# EAGLE design main (EAGLE 9.5.2)
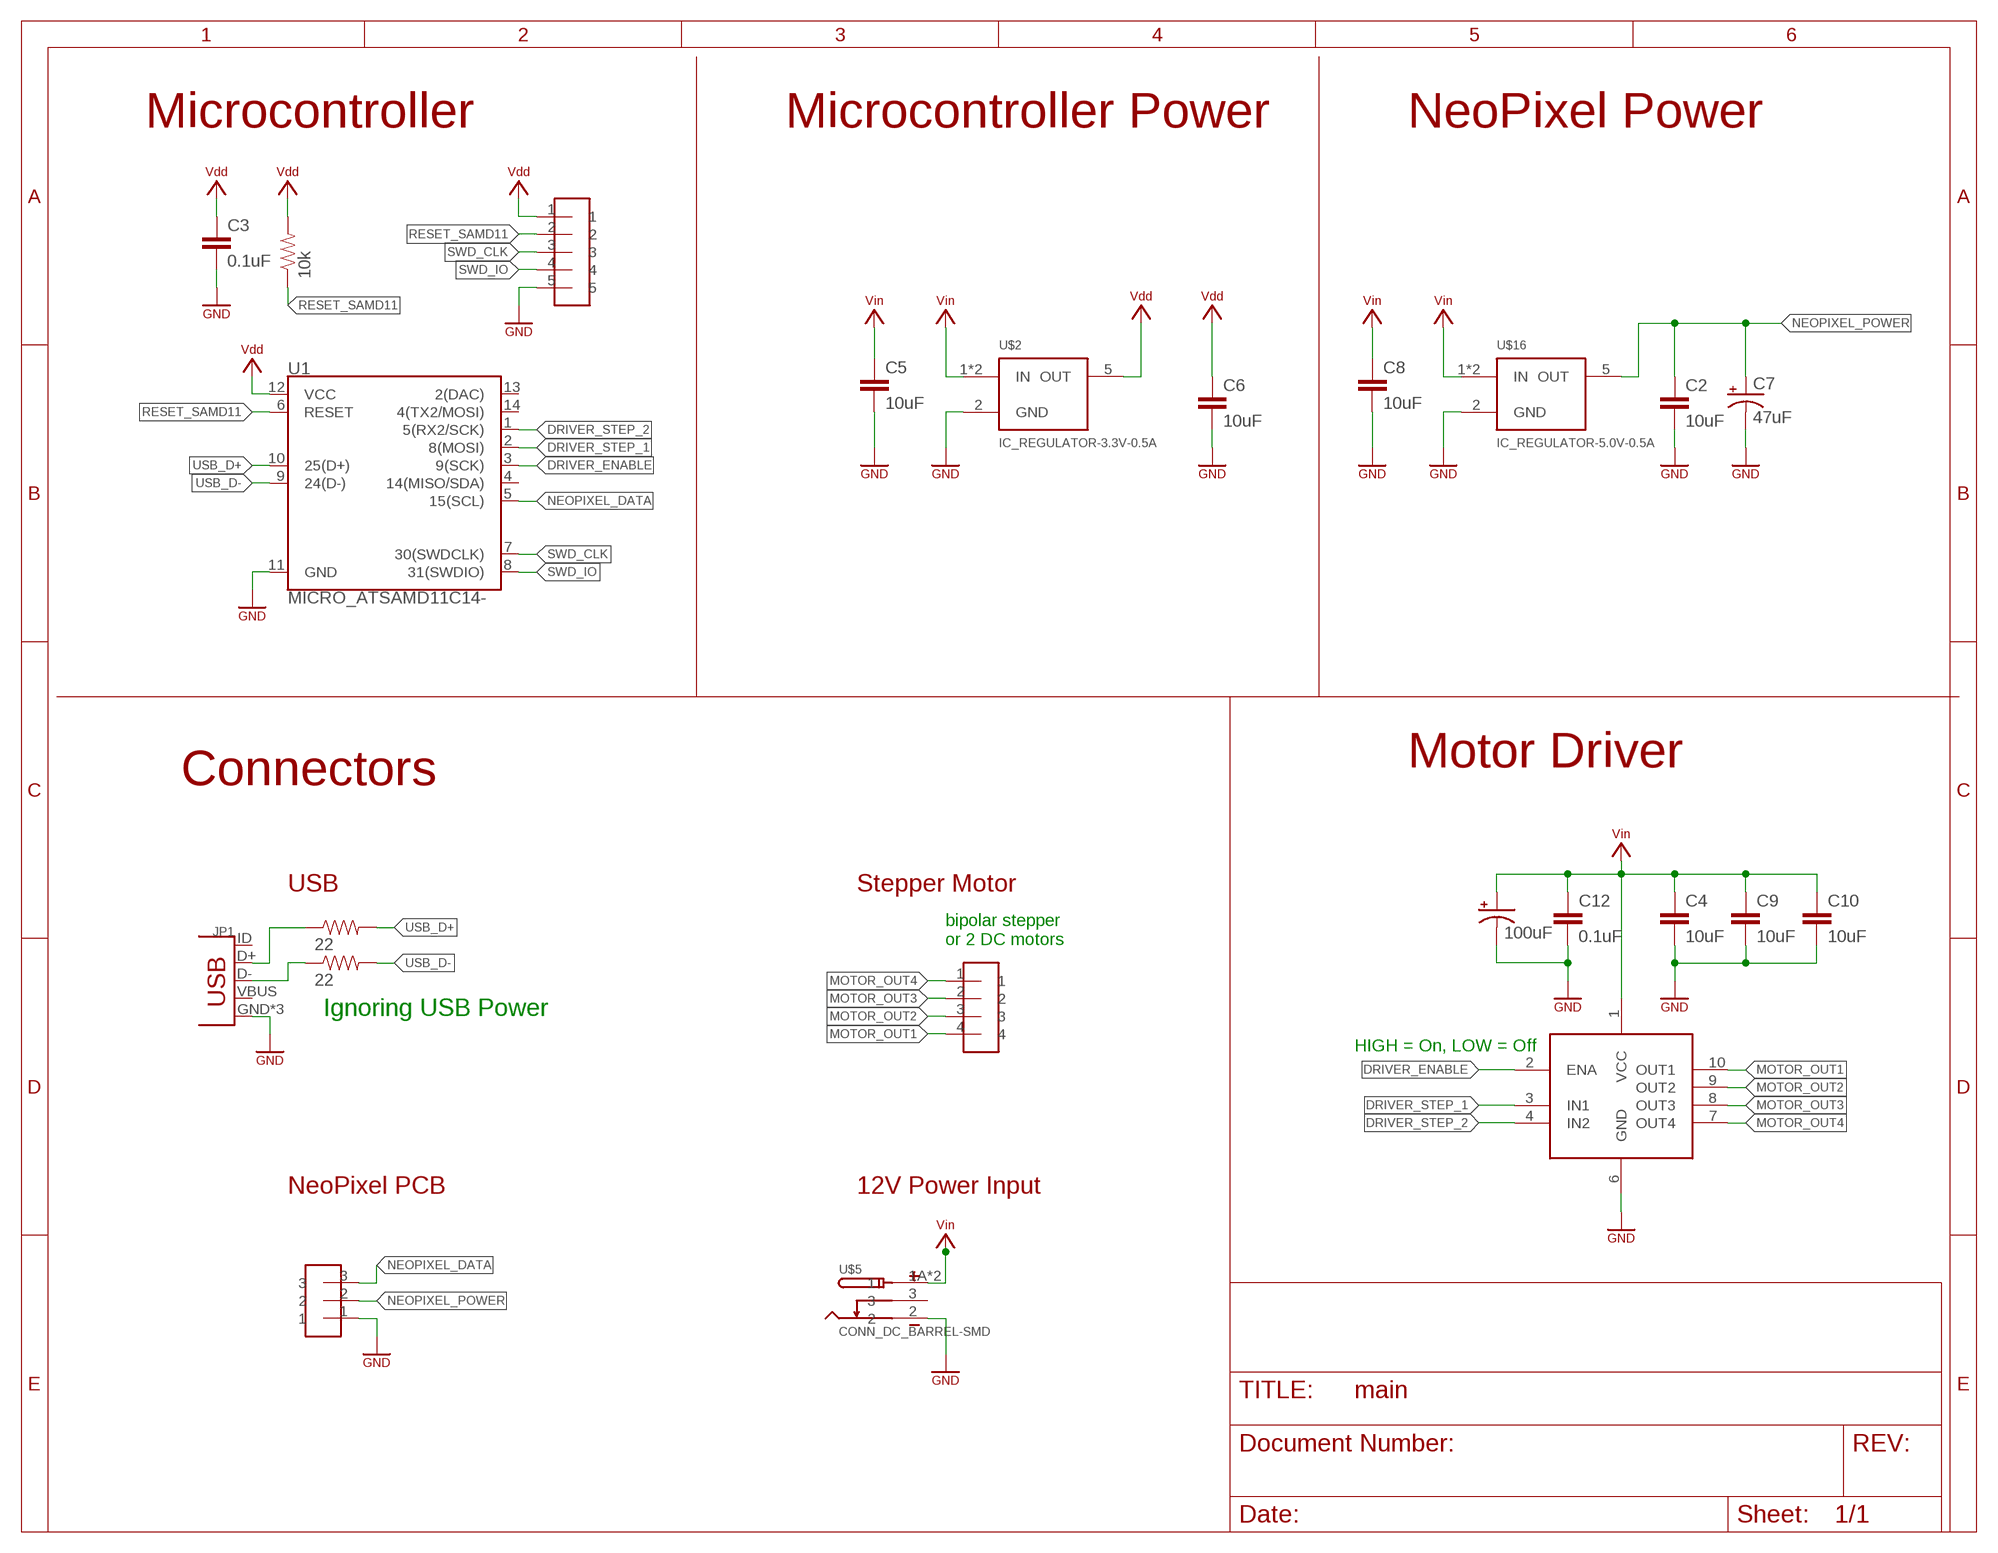
[diagram p0: schematic, sheet 1]

## Parts
C1  100uF  COMPONENT_CAP_POL-8MM  [CAP_RADIAL_CAN_8MM]
C2  10uF  COMPONENT_CAP-0805  [0805]
C3  0.1uF  COMPONENT_CAP-0805  [0805]
C4  10uF  COMPONENT_CAP-0805  [0805]
C5  10uF  COMPONENT_CAP-0805  [0805]
C6  10uF  COMPONENT_CAP-0805  [0805]
C7  47uF  COMPONENT_CAP_POL-6.3MM  [CAP_RADIAL_CAN_6.3MM]
C8  10uF  COMPONENT_CAP-0805  [0805]
C9  10uF  COMPONENT_CAP-0805  [0805]
C10  10uF  COMPONENT_CAP-0805  [0805]
C12  0.1uF  COMPONENT_CAP-0805  [0805]
JP1  CONN_USB-10118192-0001LF  [USB-MICRO-FEMALE]
R1  10k  COMPONENT_RESISTOR-0805  [0805]
R2  22  COMPONENT_RESISTOR-0805  [0805]
R3  22  COMPONENT_RESISTOR-0805  [0805]
U1  MICRO_ATSAMD11C14-  [SOIC14]
U$1  HEADER-4-HORIZONTAL  [HEADER-4-HORIZONTAL]
U$2  IC_REGULATOR-3.3V-0.5A  [SOT23-5]
U$3  IC_H_BRIDGE_LV8549MC  [SOIC10]
U$5  CONN_DC_BARREL-SMD  [694106106102]
U$10  HEADER-5-TESTPOINT  [TESTPOINT-5]
U$16  IC_REGULATOR-5.0V-0.5A  [SOT23-5]
U$17  HEADER-3-HORIZONTAL  [HEADER-3-HORIZONTAL]

## Nets
DRIVER_ENABLE: U1.3(9(SCK)) U$3.2(ENA)
DRIVER_STEP_1: U1.2(8(MOSI)) U$3.3(IN1)
DRIVER_STEP_2: U1.1(5(RX2/SCK)) U$3.4(IN2)
GND: C1.- C2.2 C3.2 C4.2 C5.2 C6.2 C7.- C8.2 C9.2 C10.2 C12.2 JP1.GND JP1.MT1(GND) JP1.MT2(GND) U1.11(GND) U$2.2(GND) U$3.6(GND) U$5.2 U$10.5 U$16.2(GND) U$17.1 ; supply symbol labelled SYMBOL_GND
MOTOR_OUT1: U$1.4 U$3.10(OUT1)
MOTOR_OUT2: U$1.3 U$3.9(OUT2)
MOTOR_OUT3: U$1.2 U$3.8(OUT3)
MOTOR_OUT4: U$1.1 U$3.7(OUT4)
N$1: JP1.D+ R2.1
N$2: JP1.D- R3.1
NEOPIXEL_DATA: U1.5(15(SCL)) U$17.3
NEOPIXEL_POWER: C2.1 C7.+ U$16.5(OUT) U$17.2
RESET_SAMD11: R1.1 U1.6(RESET) U$10.2
SWD_CLK: U1.7(30(SWDCLK)) U$10.3
SWD_IO: U1.8(31(SWDIO)) U$10.4
USB_D+: R2.2 U1.10(25(D+))
USB_D-: R3.2 U1.9(24(D-))
VDD: C3.1 C6.1 R1.2 U1.12(VCC) U$2.5(OUT) U$10.1 ; supply symbol labelled SYMBOL_VDD
VIN: C1.+ C4.1 C5.1 C8.1 C9.1 C10.1 C12.1 U$2.1(IN) U$2.3(IN) U$3.1(VCC) U$5.1A U$5.1B U$16.1(IN) U$16.3(IN) ; supply symbol labelled SYMBOL_VIN
Unconnected: JP1.ID(SHIELD) JP1.VBUS U1.4(14(MISO/SDA)) U1.13(2(DAC)) U1.14(4(TX2/MOSI)) U$5.3

## Notes on the sheet
- Microcontroller | Microcontroller Power | NeoPixel Power
- Motor Driver
- Connectors
- USB | Stepper Motor
- bipolar stepper
  or 2 DC motors
- Ignoring USB Power
- HIGH = On, LOW = Off
- NeoPixel PCB | 12V Power Input

## Library data of the parts
C1 C7 = homemade-hardware:COMPONENT_CAP_POL: Capacitor Polarized These are standard SMD and PTH capacitors. Normally 47uF, 100uF, and 470uF in electrolytic and tantalum varieties. Always verify the external diameter of the through hole cap, it varies with capacity, voltage, and manufacturer. The EIA devices should be standard.
C2-C6 C8-C10 C12 = homemade-hardware:COMPONENT_CAP: Capacitor Standard 0603 ceramic capacitor, and 0.1" leaded capacitor.
JP1 = homemade-hardware:CONN_USB: 1-1734346-1 <https://www.digikey.com/product-detail/en/te-connectivity-amp-connectors/1-1734346-1/A110862CT-ND/4142246>: USB-B Female Receptacle 10118192-0001LF <https://www.digikey.com/products/en/connectors-interconnects/usb-dvi-hdmi-connectors/312?k=10118192-0001lf&k=&pkeyword=10118192-0001lf&sv=0&pv7=2&sf=0&quantity=&ColumnSort=0&page=1&pageSize=25>: USB-Micro Receptacle 87583-3010RPALF <https://www.digikey.com/product-detail/en/amphenol-icc-fci/87583-3010RPALF/609-4946-6-ND/5355479>: USB-A Female Receptacle 0480372100 <https://www.digikey.com/product-detail/en/molex/0480372100/WM13995DKR-ND/6204368>: USB-A Male Connector; PROD_ID: CONN-09505
R1-R3 = homemade-hardware:COMPONENT_RESISTOR
U1 = homemade-hardware:MICRO_ATSAMD11C14: ATSAMD11C14A <https://www.digikey.com/product-detail/en/microchip-technology/ATSAMD11C14A-SSNT/ATSAMD11C14A-SSNTCT-ND/5956608>: Native USB M0 (arduino core <https://github.com/mattairtech/ArduinoCore-samd>)
U$1 = homemade-hardware:HEADER-4: NPTC081KFXC-RC <https://www.digikey.com/product-detail/en/sullins-connector-solutions/NPTC081KFXC-RC/S5600-ND/776058>: Vertical Female SMD Headers TSM-110-01-T-SV <https://www.digikey.com/product-detail/en/samtec-inc/TSM-110-01-T-SV/SAM12267-ND/6691889>: Vertical Male SMD Headers M20-8890845 <https://www.digikey.com/products/en?keywords=952-3236-ND>: Horizontal Male SMD Headers M20-7910842R <https://www.digikey.com/product-detail/en/harwin-inc/M20-7910842R/952-3200-6-ND/6559341>: Horizontal Female SMD Headers
U$2 = homemade-hardware:IC_REGULATOR: SPX3819M5-L-5-0/TR <https://www.digikey.com/product-detail/en/maxlinear-inc/SPX3819M5-L-5-0-TR/1016-1874-6-ND/3586704>: 5.0V/0.5A SMD Linear Regulator SPX3819M5-L-3-3/TR <https://www.digikey.com/product-detail/en/maxlinear-inc/SPX3819M5-L-3-3-TR/1016-1873-6-ND/3586703>: 3.3V/0.5A SMD Linear Regulator; PN: SPX3819M5-L-3-3/TR
U$3 = homemade-hardware:IC_H_BRIDGE_LV8549MC
U$5 = homemade-hardware:CONN_DC_BARREL: 694106106102 <https://www.digikey.com/products/en/connectors-interconnects/barrel-power-connectors/435?k=694106106102&k=&pkeyword=694106106102&sv=0&pv7=2&sf=0&quantity=&ColumnSort=0&page=1&pageSize=25>: SMD DC Barrel (OD=5.5mm, ID=2mm)
U$10 = homemade-hardware:HEADER-5: NPTC081KFXC-RC <https://www.digikey.com/product-detail/en/sullins-connector-solutions/NPTC081KFXC-RC/S5600-ND/776058>: Vertical Female SMD Headers TSM-110-01-T-SV <https://www.digikey.com/product-detail/en/samtec-inc/TSM-110-01-T-SV/SAM12267-ND/6691889>: Vertical Male SMD Headers M20-8890845 <https://www.digikey.com/products/en?keywords=952-3236-ND>: Horizontal Male SMD Headers M20-7910842R <https://www.digikey.com/product-detail/en/harwin-inc/M20-7910842R/952-3200-6-ND/6559341>: Horizontal Female SMD Headers
U$16 = homemade-hardware:IC_REGULATOR: SPX3819M5-L-5-0/TR <https://www.digikey.com/product-detail/en/maxlinear-inc/SPX3819M5-L-5-0-TR/1016-1874-6-ND/3586704>: 5.0V/0.5A SMD Linear Regulator SPX3819M5-L-3-3/TR <https://www.digikey.com/product-detail/en/maxlinear-inc/SPX3819M5-L-3-3-TR/1016-1873-6-ND/3586703>: 3.3V/0.5A SMD Linear Regulator; PN: SPX3819M5-L-5-0/TR
U$17 = homemade-hardware:HEADER-3: NPTC081KFXC-RC <https://www.digikey.com/product-detail/en/sullins-connector-solutions/NPTC081KFXC-RC/S5600-ND/776058>: Vertical Female SMD Headers TSM-110-01-T-SV <https://www.digikey.com/product-detail/en/samtec-inc/TSM-110-01-T-SV/SAM12267-ND/6691889>: Vertical Male SMD Headers M20-8890845 <https://www.digikey.com/products/en?keywords=952-3236-ND>: Horizontal Male SMD Headers M20-7910842R <https://www.digikey.com/product-detail/en/harwin-inc/M20-7910842R/952-3200-6-ND/6559341>: Horizontal Female SMD Headers

## Board
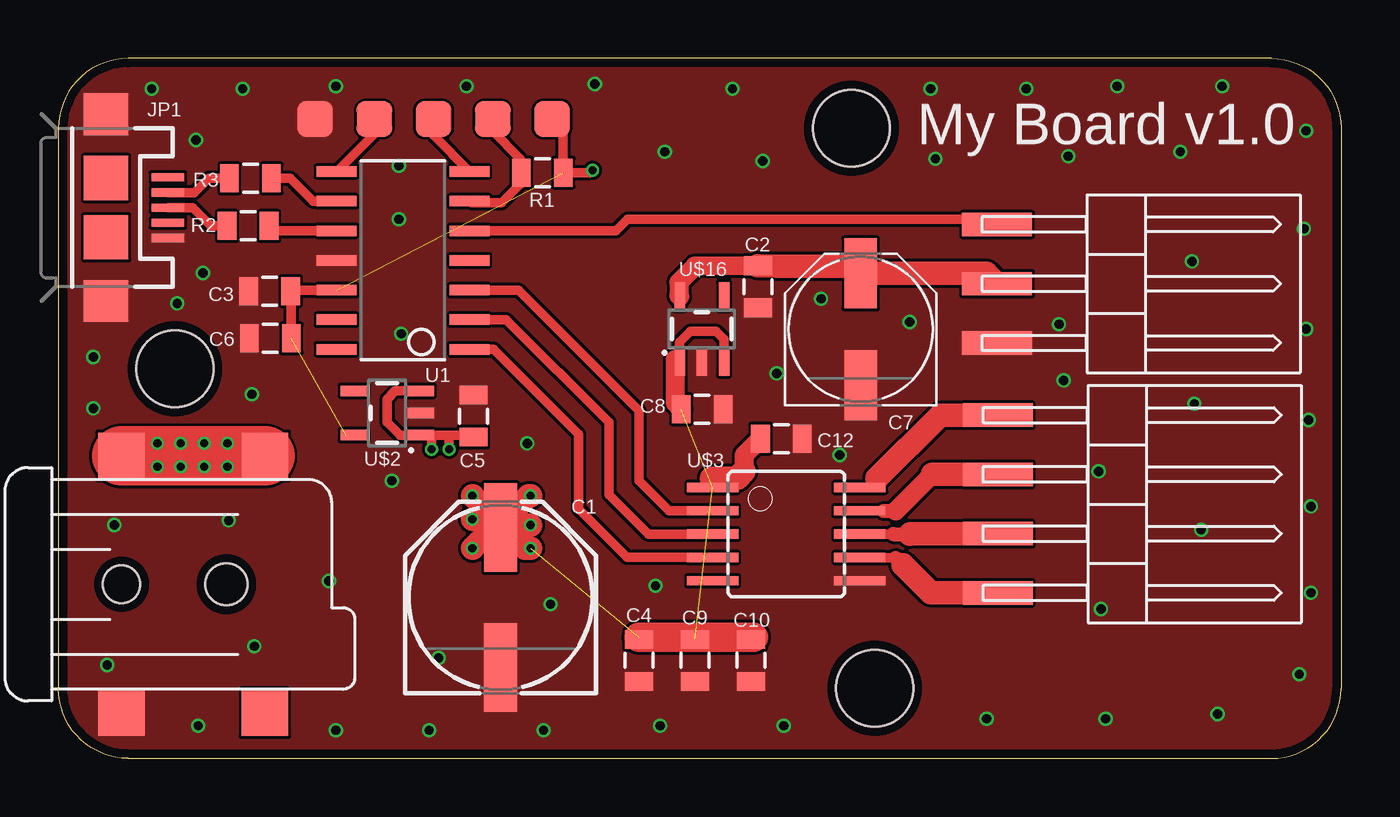
[diagram p1: board, top side]
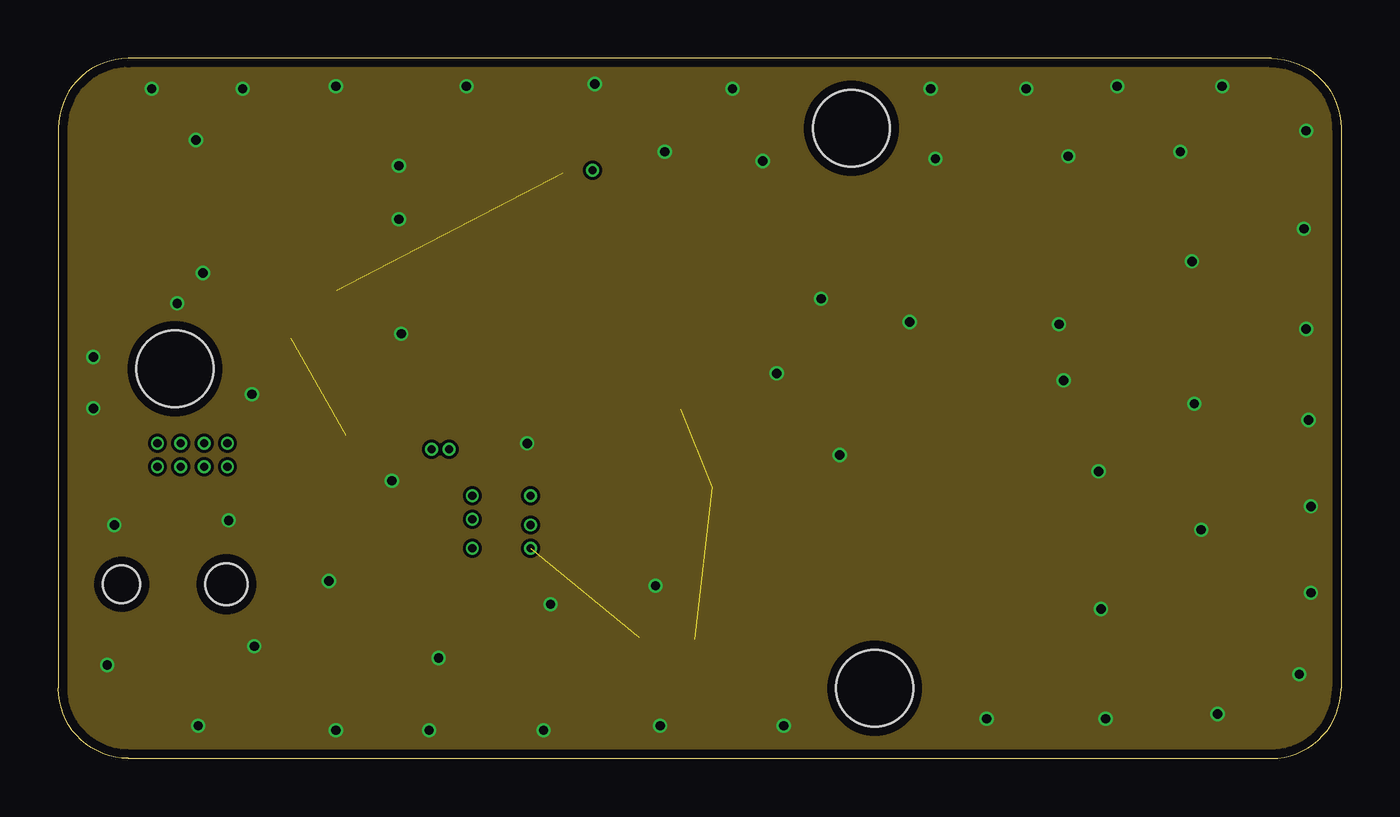
[diagram p2: board, inner layer Route2]
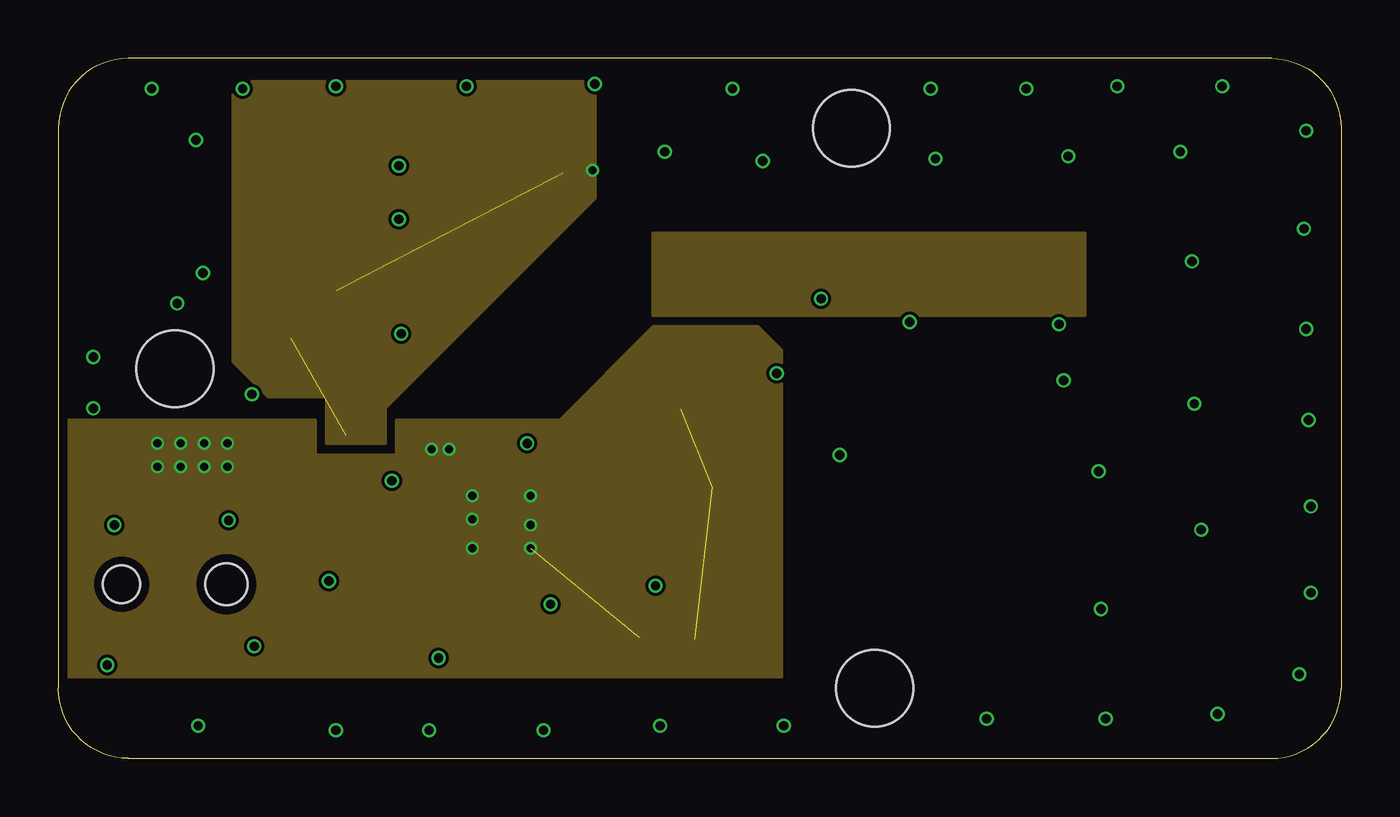
[diagram p3: board, inner layer Route15]
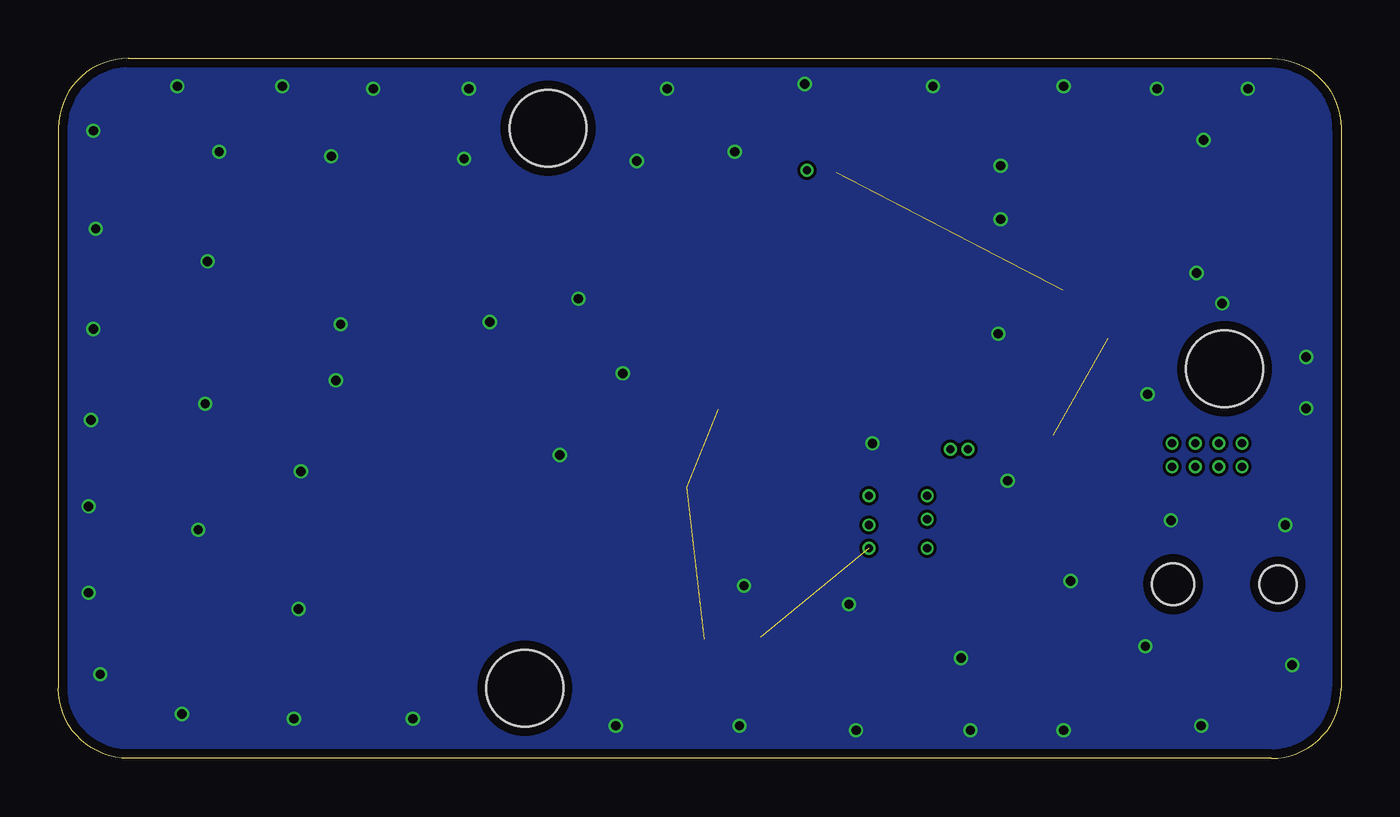
[diagram p4: board, bottom side, seen from below]

Size 55 x 30 mm. Coordinates in mm from the lower left corner, seen from the top.
Outline: 3,0 52,0 arc90 55,3 55,27 arc90 52,30 3,30 arc90 0,27 0,3 arc90 3,0
Copper layers (1*2*15*16): Top 0.035559375mm / dielectric 0.17018125mm / Route2 0.01778125mm / dielectric 47mil / Route15 0.01778125mm / dielectric 0.17018125mm / Bottom 0.035559375mm
Design rules "oshpark-4layer": minimum track width 5mil, minimum drill 10mil, track to track 5mil, track to pad 5mil, pad to pad 5mil, via to via 5mil, smd to smd 5mil, copper to edge 15mil, drill to drill 6mil, minimum pad ring 4mil, minimum via ring 4mil, stop-mask expansion 2.5mil, vias tented up to drill 0mil, thermal gap 10mil
Holes 3.3 mm at 34,27 35,3 5,16.7

### Footprints (pad centres in the part's own frame; a part is rotated, then mirrored left to right if it is on the bottom)
CAP_RADIAL_CAN_8MM = smd 3.8 x 1.4: + 3,0; - -3,0
0805 = smd 0.8 x 1.2: 1 -0.9,0; 2 0.9,0
CAP_RADIAL_CAN_6.3MM = smd 3 x 1.4: + 2.4,0; - -2.4,0
USB-MICRO-FEMALE = smd 0.35 x 1.4: D+ 0,2.65; D- -0.65,2.65; GND 1.3,2.65; ID 0.65,2.65; VBUS -1.3,2.65 | smd 1.8 x 1.9: MT1 -4,0; MT2 4,0 | smd 1.9 x 1.9: P$1 -1.27,0; P$2 1.27,0
SOIC14 = smd 0.45 x 1.708: 1 -3.81,-2.854; 2 -2.54,-2.854; 3 -1.27,-2.854; 4 0,-2.854; 5 1.27,-2.854; 6 2.54,-2.854; 7 3.81,-2.854; 8 3.81,2.854; 9 2.54,2.854; 10 1.27,2.854; 11 0,2.854; 12 -1.27,2.854; 13 -2.54,2.854; 14 -3.81,2.854
HEADER-4-HORIZONTAL = smd 3 x 1: 1 0,0; 2 0,2.54; 3 0,5.08; 4 0,7.62
SOT23-5 = smd 0.45 x 1.2: 1 -0.95,-1.4; 2 0,-1.4; 3 0.95,-1.4; 4 0.95,1.4; 5 -0.95,1.4
SOIC10 = smd 0.4 x 2.2: 1 -2,-3.154; 2 -1,-3.154; 3 0,-3.154; 4 1,-3.154; 5 2,-3.154; 6 2,3.154; 7 1,3.154; 8 0,3.154; 9 -1,3.154; 10 -2,3.154
694106106102 = smd 2 x 2: 1A 6.15,5.5; 1B 0,5.5; 2 0,-5.5; 3 6.15,-5.5 | hole 1.6: 0,0 | hole 1.8: 4.5,0
TESTPOINT-5 = smd 1.524 x 1.524: 1 0,0; 2 2.54,0; 3 5.08,0; 4 7.62,0; 5 10.16,0
HEADER-3-HORIZONTAL = smd 3 x 1: 1 0,0; 2 0,2.54; 3 0,5.08

### Placement (x,y rotation side)
C1  18.96,6.89 90 top
C2  29.99,20.21 270 top
C3  9.06,20.02 180 top
C4  24.9,4.2 270 top
C5  17.8,14.67 90 top
C6  9.09,18 180 top
C7  34.4,18.38 90 top
C8  27.6,14.97 0 top
C9  27.3,4.2 270 top
C10  29.7,4.2 270 top
C12  31,13.7 0 top
JP1  2.05,23.6 270 top
R1  20.75,25.1 0 top
R2  8.14,22.82 0 top
R3  8.24,24.86 0 top
U1  14.78,21.34 90 top
U$1  40.28,7.09 0 top
U$2  14.1,14.8 90 top
U$3  31.21,9.61 270 top
U$5  2.71,7.46 0 top
U$10  21.17,27.4 180 top
U$16  27.59,18.4 0 top
U$17  40.24,17.8 0 top

### Tracks (layer width: path | path; a pad name or v marks a point on that pad's centre or on a via)
DRIVER_ENABLE
  Top 0.406: U$3.2 26.19,10.61 24.9,11.9 24.9,14.9 19.73,20.07 U1.3
DRIVER_STEP_1
  Top 0.406: U1.2 19.2,18.8 23.6,14.4 23.6,11.3 25.3,9.6 28.05,9.6 U$3.3
DRIVER_STEP_2
  Top 0.406: U$3.4 24.39,8.61 22.3,10.7 22.3,13.9 18.67,17.53 U1.1
GND  (via drill 0.4)
  other vias: 1.5,15 1.5,17.2 5.1,19.5 6.2,20.8 8.3,15.6 5.9,26.5 4,28.7 7.9,28.7 11.9,28.8 17.5,28.8 23,28.9 28.9,28.7 37.4,28.7 41.5,28.7 45.4,28.8 49.9,28.8 53.5,26.9 53.4,22.7 53.5,18.4 53.6,14.5 53.7,10.8 53.7,7.1 53.2,3.6 49.7,1.9 44.9,1.7 39.8,1.7 31.1,1.4 25.8,1.4 20.8,1.2 15.9,1.2 11.9,1.2 6,1.4 2.1,4 2.4,10 7.3,10.2 8.4,4.8 11.6,7.6 16.3,4.3 21.1,6.6 25.6,7.4 33.5,13 30.8,16.5 32.7,19.7 36.5,18.7 43.1,16.2 42.9,18.6 48.1,26 48.6,21.3 48.7,15.2 49,9.8 44.6,12.3 44.7,6.4 43.3,25.8 37.6,25.7 30.2,25.6 26,26 14.6,25.4 14.6,23.1 14.7,18.2 14.3,11.9 20.1,13.5
  pour Top (no thermals): -2,32 57,32 57,-2 -2,-2
  pour Bottom (no thermals): -4,34 59,34 59,-4 -4,-4
  pour Route2 (no thermals): -6,36 61,36 61,-6 -6,-6
MOTOR_OUT1
  Top 0.406: U$3.10 34.71,11.61 35.1,12
  Top 1.016: U$1.4 37.81,14.71 35.1,12
MOTOR_OUT2
  Top 0.406: U$3.9 35.39,10.61
  Top 0.61: 35.39,10.61 35.91,10.61
  Top 0.813: 35.91,10.61 37.47,12.17
  Top 1.016: U$1.3 37.47,12.17
MOTOR_OUT3
  Top 0.406: U$3.8 35.79,9.61
  Top 0.61: 35.79,9.61 36.51,9.61
  Top 1.016: 36.51,9.61 36.53,9.63 U$1.2
MOTOR_OUT4
  Top 0.406: 35.91,8.59 34.38,8.59 U$3.7
  Top 0.61: 36.2,8.3 35.91,8.59
  Top 1.016: U$1.1 37.41,7.09 36.2,8.3
N$1
  Top 0.406: JP1.D+ 5.76,23.6 6.54,22.82 R2.1
N$2
  Top 0.406: R3.1 6.44,24.86 5.83,24.25 JP1.D-
NEOPIXEL_DATA
  Top 0.406: U$17.3 40.02,23.1 24.4,23.1 23.91,22.61 U1.5
NEOPIXEL_POWER
  Top 0.813: C2.1 27.29,21.09 26.6,20.4 26.6,19.84 U$16.5
  Top 1.016: C2.1 30.82,21.08 34.1,21.08 C7.+ 39.8,20.78 U$17.2
  pour Route15: 25.5,19 44,19 44,22.5 25.5,22.5
RESET_SAMD11
  Top 0.406: U$10.2 18.63,26.87 19.8,25.7 19.8,25 | 19.8,25 19.8,24.6 19,23.8 17.71,23.8 U1.6 | R1.1 19.85,25.05 19.8,25
SWD_CLK
  Top 0.406: U$10.3 16.09,26.69 U1.7
SWD_IO
  Top 0.406: U$10.4 13.55,26.77 U1.8
USB_D+
  Top 0.406: R2.2 9.25,22.61 U1.10
USB_D-
  Top 0.406: U1.9 10.92,23.88 9.94,24.86 R3.2
VDD  (via drill 0.35)  (2 unrouted)
  Top 0.406: 9.99,20.05 C3.1 | C6.1 9.99,20.05 | U$2.5 12.34,13.85 | U$10.1 21.65,26.92 R1.2 22.8,25.1 v22.9,25.2 | U1.12 10.01,20.07 9.99,20.05
  pour Route15: 11.5,14.5 11.5,13.5 14,13.5 14,15 23,24 23,29 8,29 7.5,28.5 7.5,17 9,15.5 10.5,15.5 11.5,15.5
VIN  (via drill 0.35)  (3 unrouted)
  Top 0.406: U$3.1 28,11.67 28,12.01 | 26.44,17.1 26.54,17 U$16.1 26.64,17.84 27.1,18.3 28.2,18.3 28.54,17.96 U$16.3 | 16,13.85 U$2.1 14.65,13.85 14.1,14.4 14.1,15.4 14.45,15.75 U$2.3 | 16,13.85 16.75,13.85 | 16.75,13.85 17.72,13.85 C5.1 | U$5.1A 8.4,12.5 v7.25,12.5 | v16,13.25 16,13.85 | v16.75,13.25 16.75,13.85
  Top 0.813: C8.1 26.44,15.23 26.44,17.1 | C4.1 C9.1 | C10.1 C9.1 | C12.1 29.4,13 29.4,12.3 | C9.1 27.4,5.2 27.5,5.2
  Top 1.016: 29.4,12.3 29.11,12.01 28,12.01 | v17.75,11.25 18.96,10.04 | 18.96,10.04 C1.+ 18.6,10.25 | v17.75,10.25 18.6,10.25 | v17.75,9 18.6,9.85 18.6,10.25 | v20.25,9 20,9 19,10 | v20.25,10 19,10 | 19,10 18.96,10.04 | v20.25,11.25 20.17,11.25 18.96,10.04
  Top 1.27: 24.9,5.2 27.5,5.2 29.8,5.2
  Top 2.54: U$5.1B U$5.1A
  other vias: 4.25,12.5 5.25,12.5 6.25,12.5 4.25,13.5 5.25,13.5 6.25,13.5 7.25,13.5
  pour Route15: -4.5,14.5 11,14.5 11,13 14.5,13 14.5,14.5 21.5,14.5 25.5,18.5 30,18.5 31,17.5 31,3.5 -4.5,3.5

### Text on the board
tPlace: My Board v1.0